# EAGLE design V-00756-00 (EAGLE 7.2.0)
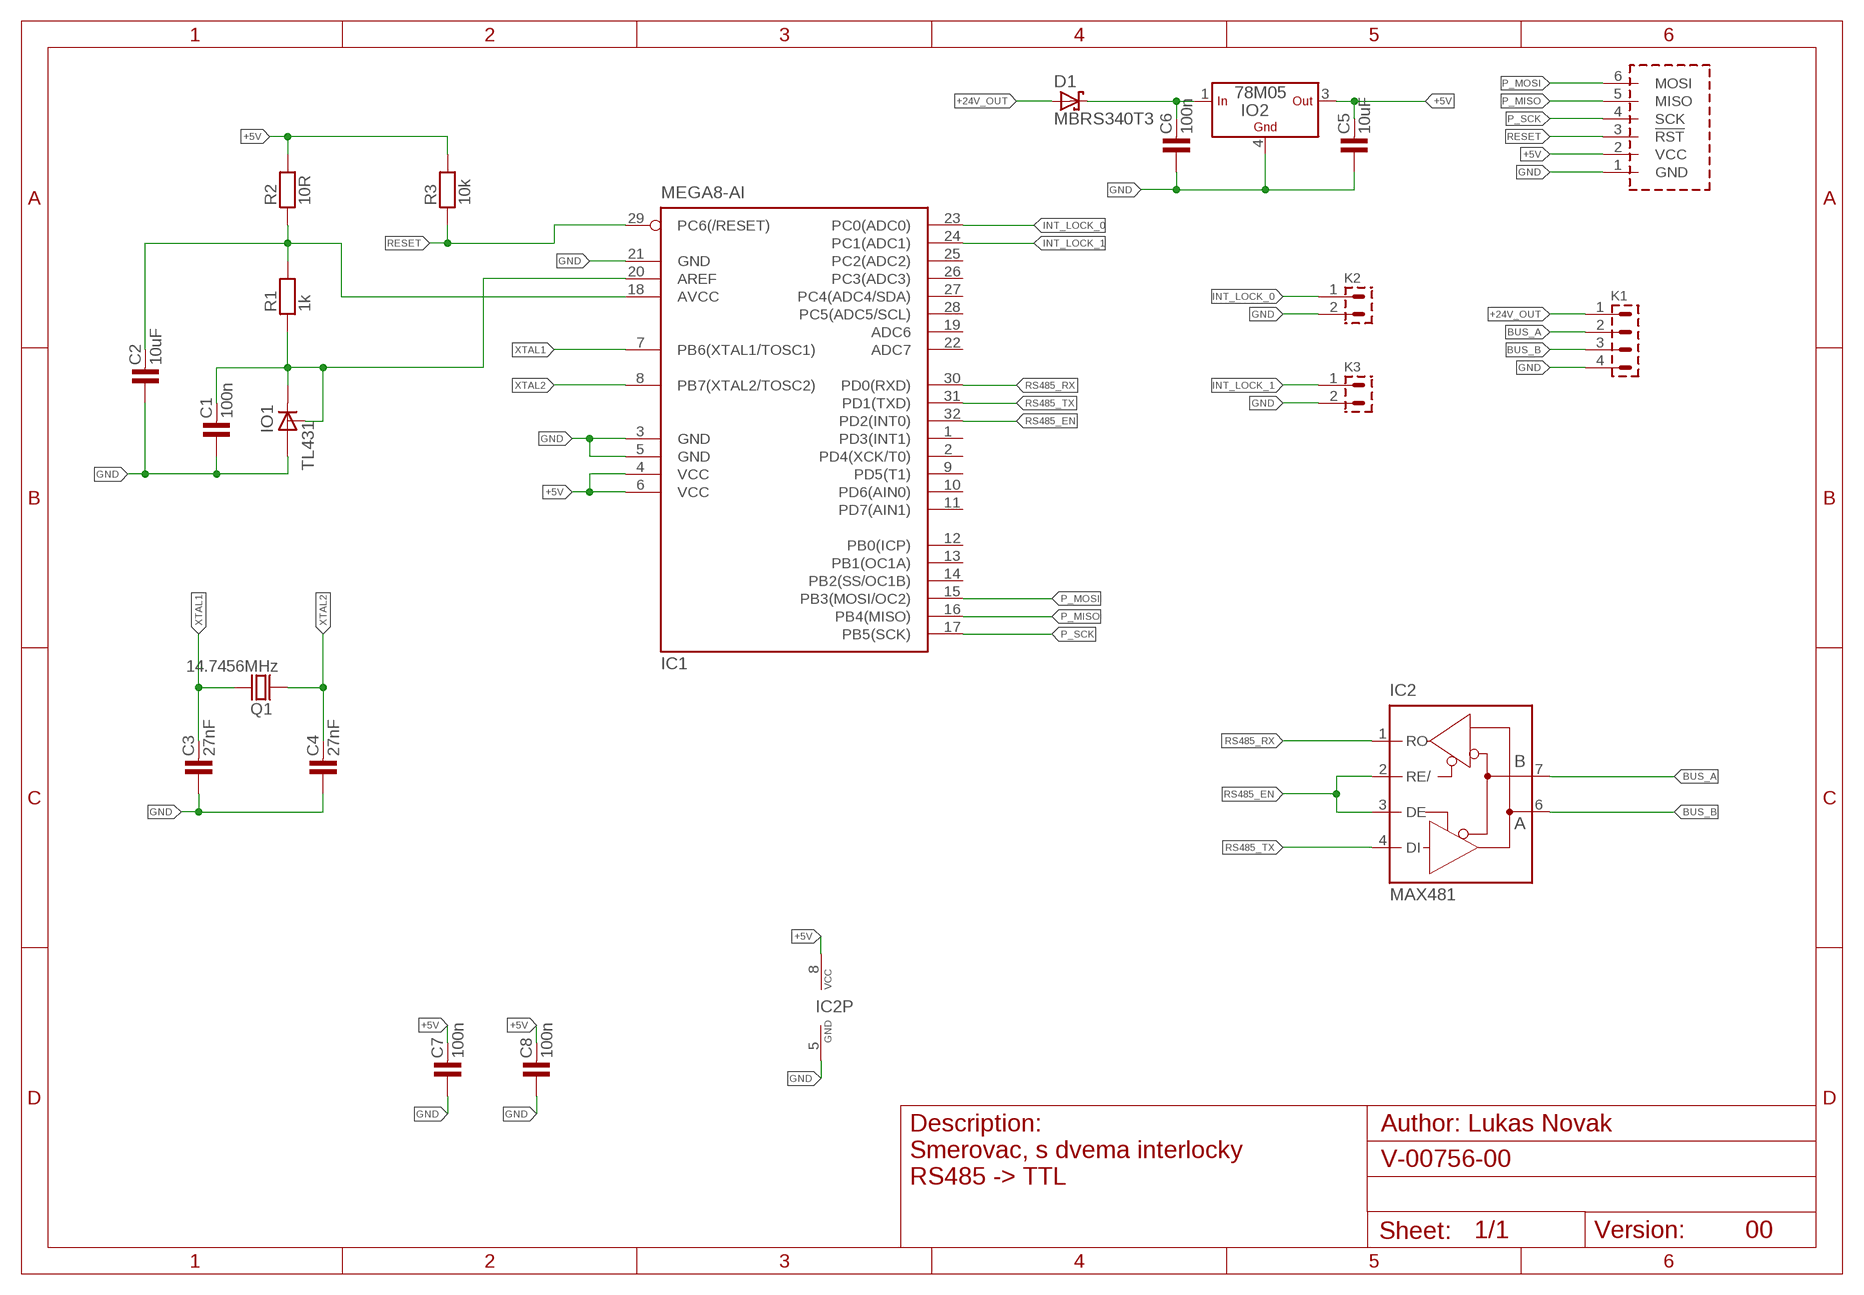
[diagram p0: schematic, sheet 1]

## Parts
C1  100n  C-KER_1206  [1206]
C2  10uF  C-KER_1206  [1206]
C3  27nF  C-KER_0805  [0805]
C4  27nF  C-KER_0805  [0805]
C5  10uF  C-KER_1206  [1206]
C6  100n  C-KER_1206  [1206]
C7  100n  C-KER_1206  [1206]
C8  100n  C-KER_1206  [1206]
D1  MBRS340T3  [SMC]
IC1  MEGA8-AI  [TQFP32-08]
IC2  MAX481  MAX481CSA  [SO08]
IO1  TL431  TL431SOT23  [SOT23]
IO2  78M05  LF_CDT  [DPAK]
K1  PSH02-04W  [PSH02-04W]
K2  PSH02-02W  [PSH02-02W]
K3  PSH02-02W  [PSH02-02W]
Q1  14.7456MHz  Q_HC-49U  [HC-49U]
R1  1k  R_1206  [1206]
R2  10R  R_1206  [1206]
R3  10k  R_1206  [1206]
U$1  AVR_PROG_SPI  [PSH02-06P]

## Nets
+5V: C5.2 C7.2 C8.2 IC1.4(VCC) IC1.6(VCC) IC2.8(VCC) IO2.3(OUT) R2.2 R3.2 U$1.2(VCC)
+24V: C6.2 D1.C IO2.1(IN)
+24V_OUT: D1.A K1.1
AREF: C1.2 IC1.20(AREF) IO1.1(C) IO1.2(R) R1.1
AVCC: C2.2 IC1.18(AVCC) R1.2 R2.1
BUS_A: IC2.7(B) K1.2
BUS_B: IC2.6(A) K1.3
GND: C1.1 C2.1 C3.1 C4.1 C5.1 C6.1 C7.1 C8.1 IC1.3(GND) IC1.5(GND) IC1.21(GND) IC2.5(GND) IO1.3(A) IO2.4(GND) K1.4 K2.2 K3.2 U$1.1(GND)
INT_LOCK_0: IC1.23(PC0(ADC0)) K2.1
INT_LOCK_1: IC1.24(PC1(ADC1)) K3.1
P_MISO: IC1.16(PB4(MISO)) U$1.5(MISO)
P_MOSI: IC1.15(PB3(MOSI/OC2)) U$1.6(MOSI)
P_SCK: IC1.17(PB5(SCK)) U$1.4(SCK)
RESET: IC1.29(PC6(/RESET)) R3.1 U$1.3(!RST)
RS485_EN: IC1.32(PD2(INT0)) IC2.2(RE/) IC2.3(DE)
RS485_RX: IC1.30(PD0(RXD)) IC2.1(RO)
RS485_TX: IC1.31(PD1(TXD)) IC2.4(DI)
XTAL1: C3.2 IC1.7(PB6(XTAL1/TOSC1)) Q1.2
XTAL2: C4.2 IC1.8(PB7(XTAL2/TOSC2)) Q1.1
Unconnected: IC1.1(PD3(INT1)) IC1.2(PD4(XCK/T0)) IC1.9(PD5(T1)) IC1.10(PD6(AIN0)) IC1.11(PD7(AIN1)) IC1.12(PB0(ICP)) IC1.13(PB1(OC1A)) IC1.14(PB2(SS/OC1B)) IC1.19(ADC6) IC1.22(ADC7) IC1.25(PC2(ADC2)) IC1.26(PC3(ADC3)) IC1.27(PC4(ADC4/SDA)) IC1.28(PC5(ADC5/SCL))

## Notes on the sheet
- Smerovac, s dvema interlocky
  RS485 -> TTL
- 00

## Library data of the parts
C1-C8 = #PaJa_31:C-KER: Kondenzator - keramicky
D1 = diode:MBRS3*0T3: SCHOTTKY BARRIER RECTIFIER 3.0 AMPERES 20, 30, 40 VOLT Source: MBRS340T3-D.pdf
IC1 = atmel:MEGA8: MICROCONTROLLER 8 Kbytes FLASH, 1 kbytes SRAM, 512 bytes EEPROM, USART, 6-channel 10 bit ADC, 2-channel 8 bit ADC Pin compatible with Atmega48, ATMega88, ATMega168 Source: avr.lbr; MPN: ATMEGA8-16AU; OC_FARNELL: 9171371; OC_NEWARK: 73M8863
IC2 = maxim:MAX481CSA: RS485 TRANSEIVER; MF: MAXIM; MPN: MAX481CSA; OC_FARNELL: unknown; OC_NEWARK: 90C3817
IO1 = references:TL431: Programmable Shunt Regulator TL431 Features > Programmable Output Voltage to 36 Volts > Low Dynamic Output Impedance 0.2? Typical > Sink Current Capability of 1.0 to 100mA > Equivalent Full-Range Temperature Coefficient of 50ppm/°C Typical > Temperature Compensated For Operation Over Full Rated Operating Temperature Range > Low Output Noise Voltage > Fast Turn-on Response; MPN: TL431BFDT; OC_FARNELL: 2095471; PACKAGE: SOT23; SUPPLIER: NXP
IO2 = #PaJa_31:LF_C: LF??C - stabilizatory low-drop Out= 1,5 / 1,8 / 2,5 / 3,3 / 4,7 / 5 / 6 / 8 / 5,5 / 9 / 12 V Avaiable in +- 1% (AB) , +- 2% (C)
K1 = #PaJa_konektory:PSH02-04: Konektory se zamkem - vidlice - 4pin
K2 K3 = #PaJa_konektory:PSH02-02: Konektory se zamkem - vidlice - 2pin
Q1 = #PaJa_31:Q: Krystal HC-49 - 1MHz - 48MHz DT38 - Quartz (hodinovy) 32,768kHz
R1-R3 = #PaJa_31:R: Rezistor
U$1 = #PaJa_konektory:AVR_PROG_SPI

## Net classes
0 default: width 0.305 mm, drill 0.3 mm, clearance 0.2 mm
2 Supply: width 0.305 mm, drill 0.3 mm, clearance 0.4 mm to class 0
3 Ground: width 0.305 mm, drill 0.3 mm, clearance 0.2 mm to class 0

## Board
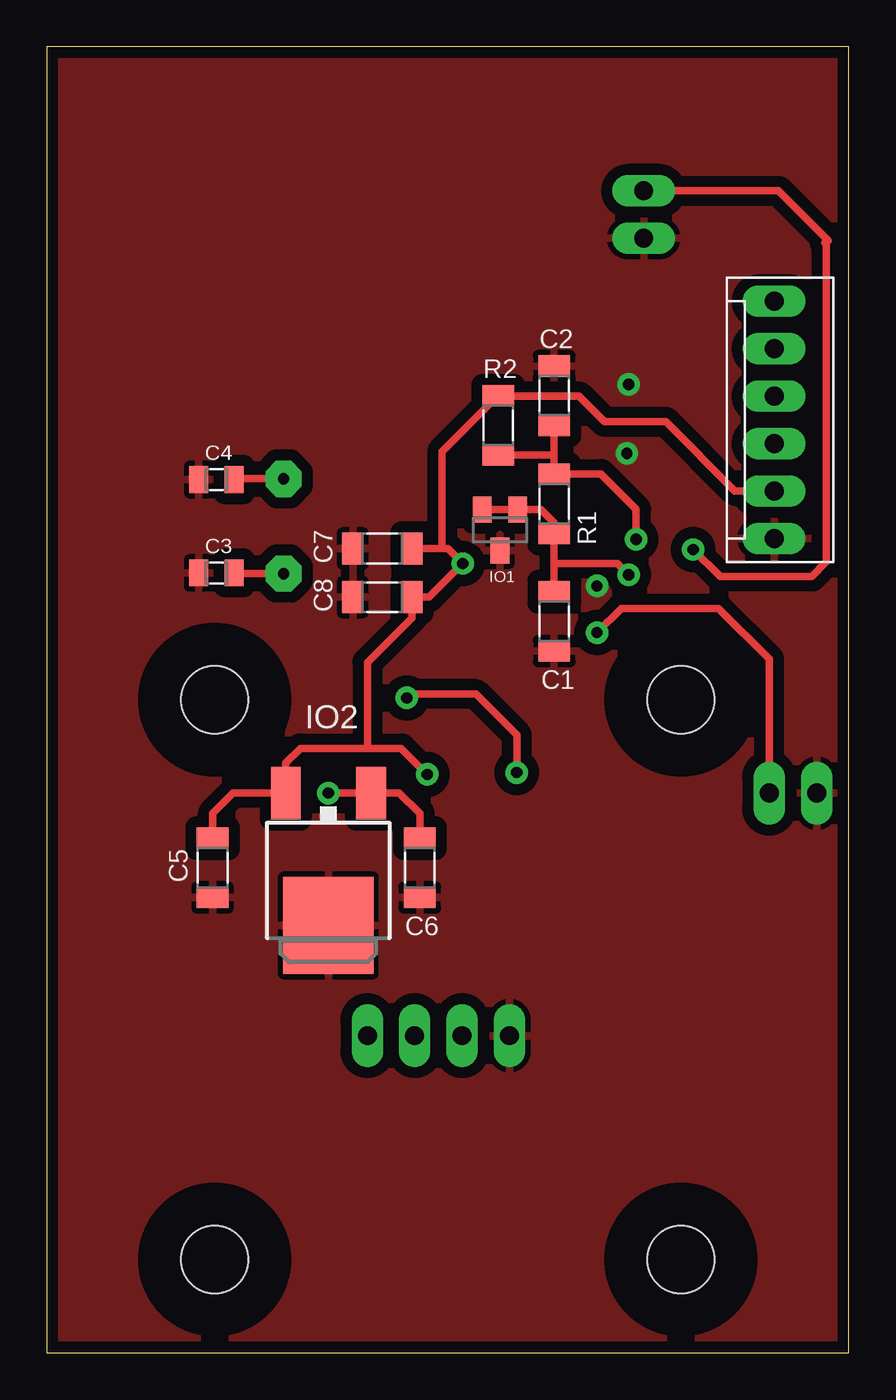
[diagram p1: board, top side]
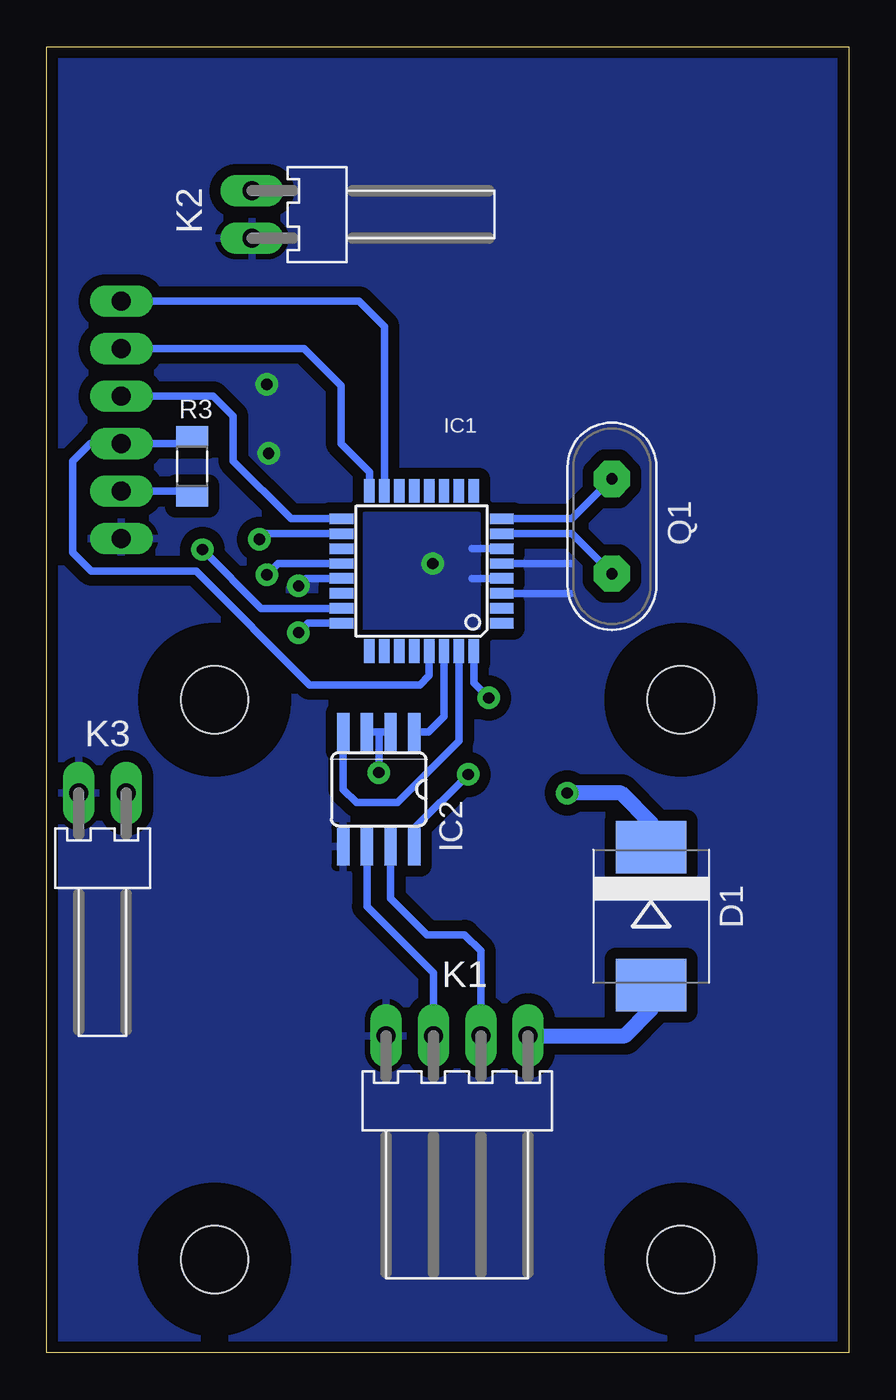
[diagram p2: board, bottom side, seen from below]

Size 43 x 70 mm. Coordinates in mm from the lower left corner, seen from the top.
Outline: 0,0 43,0 43,70 0,70 0,0
Copper layers (1*16): Top 0.04mm / dielectric 1.5mm / Bottom 0.04mm
Design rules "mucha_navrh *": minimum track width 0.2mm, minimum drill 0.6mm, track to track 0.5mm, track to pad 0.5mm, pad to pad 0.3mm, via to via 0.3mm, smd to smd 0mil, copper to edge 0.01mm, drill to drill 0.5mm, minimum pad ring 0.3mm, minimum via ring 0.3mm, stop-mask expansion 0.1mm, vias tented up to drill 0.8mm, thermal gap 0.3mm
Holes 3.6 mm at 9,5 34,5 9,35 34,35
tRestrict: area 30.5,1.5 to 37.5,8.5; area 5.5,1.5 to 12.5,8.5; area 5.5,31.5 to 12.5,38.5; area 30.5,31.5 to 37.5,38.5
bRestrict: area 5.5,1.5 to 12.5,8.5; area 30.5,1.5 to 37.5,8.5; area 5.5,31.5 to 12.5,38.5; area 30.5,31.5 to 37.5,38.5

### Footprints (pad centres in the part's own frame; a part is rotated, then mirrored left to right if it is on the bottom)
1206 = smd 1.143 x 1.702: 1 -1.587,0; 2 1.587,0
0805 = smd 1.016 x 1.422: 1 -0.953,0; 2 0.953,0
SMC = smd 2.8 x 3.8: A 3.7,0; C -3.7,0
TQFP32-08 = smd 1.27 x 0.559: 1 -4.293,2.8; 2 -4.293,2; 3 -4.293,1.2; 4 -4.293,0.4; 5 -4.293,-0.4; 6 -4.293,-1.2; 7 -4.293,-2; 8 -4.293,-2.8; 17 4.293,-2.8; 18 4.293,-2; 19 4.293,-1.2; 20 4.293,-0.4; 21 4.293,0.4; 22 4.293,1.2; 23 4.293,2; 24 4.293,2.8 | smd 0.559 x 1.27: 9 -2.8,-4.293; 10 -2,-4.293; 11 -1.2,-4.293; 12 -0.4,-4.293; 13 0.4,-4.293; 14 1.2,-4.293; 15 2,-4.293; 16 2.8,-4.293; 25 2.8,4.293; 26 2,4.293; 27 1.2,4.293; 28 0.4,4.293; 29 -0.4,4.293; 30 -1.2,4.293; 31 -2,4.293; 32 -2.8,4.293
SO08 = smd 0.66 x 2.032: 1 -1.905,-3.073; 2 -0.635,-3.073; 3 0.635,-3.073; 4 1.905,-3.073; 5 1.905,3.073; 6 0.635,3.073; 7 -0.635,3.073; 8 -1.905,3.073
SOT23 = smd 1 x 1.4: 1 -0.95,-1.1; 2 0.95,-1.1; 3 0,1.1
DPAK = smd 1.6 x 2.8: 1 -2.28,-4.992; 3 2.28,-4.992 | smd 4.826 x 5.191: 4 0,2.096
PSH02-04W = drill 1.016 pad 1.422 long: 1 -3.81,0; 2 -1.27,0; 3 1.27,0; 4 3.81,0
PSH02-02W = drill 1.016 pad 1.422 long: 1 -1.27,0; 2 1.27,0
HC-49U = drill 0.61 pad 1.93 octagon: 1 -2.54,0; 2 2.54,0
PSH02-06P = drill 1.016 pad 1.422 long: 1 -6.35,0; 2 -3.81,0; 3 -1.27,0; 4 1.27,0; 5 3.81,0; 6 6.35,0

### Placement (x,y rotation side)
C1  27.2,39.2 90 top
C2  27.2,51.3 270 top
C3  9.1,41.8 0 top
C4  9.1,46.8 0 top
C5  8.9,26 90 top
C6  20,26 90 top
C7  18,43.1 0 top
C8  18,40.5 0 top
D1  10.6,23.4 270 bottom
IC1  22.9,41.9 180 bottom
IC2  25.2,30.2 180 bottom
IO1  24.3,44.1 180 top
IO2  15.1,25 180 top
K1  21,17 180 bottom
K2  32,61 270 bottom
K3  40,30 180 bottom
Q1  12.7,44.3 270 bottom
R1  27.2,45.5 90 top
R2  24.2,49.7 90 top
R3  35.2,47.5 270 bottom
U$1  39,50 90 top
U$2  [A4L-LOC]  -104.9,-60.5 0 top  (outside the outline)

### Tracks (layer width: path | path; a pad name or v marks a point on that pad's centre or on a via)
+5V  (via drill 0.6)
  Top 0.406: C5.2 8.9,28.9 10,30 10.01,29.99 IO2.3 12.8,30.01 12.8,31.6 13.6,32.4 17.2,32.4 | 17.2,32.4 19,32.4 v20.4,31 | 17.2,32.4 17.2,37 19.59,39.39 C8.2 20.5,40.5 v22.3,42.3 | v22.3,42.3 22.2,42.3 | C7.2 21.2,43.1 | 21.2,43.1 21.5,43.1 v22.3,42.3 | 21.2,43.1 21.2,48.29 R2.2 24.22,51.27 28.53,51.27 29.9,49.9 33.19,49.9 36.9,46.19 U$1.2
  Bottom 0.406: IC1.6 20.2,43.1 | IC1.4 20.2,41.5 | v20.4,31 23.3,28.11 IC2.8 | U$1.2 35.48,46.19 R3.2
  pour Bottom (rank 5): 25.9,38.9 19.9,38.9 19.9,44.9 25.9,44.9
+24V  (via drill 0.6)
  Top 0.406: C6.2 20,28.9 18.9,30 18.89,29.99 IO2.1 15.71,29.99 v15.1,30
  Bottom 0.813: D1.C 10.6,28.4 12.2,30 v15.1,30
+24V_OUT
  Bottom 0.813: K1.1 12,17 10.6,18.4 D1.A
AREF  (via drill 0.6)
  Top 0.406: IO1.2 IO1.1 26.5,45.2 27.2,44.5 R1.1 IC1.20 | IC1.20 C1.2 | v31.2,41.7 30.6,42.3 IC1.20
  Bottom 0.406: IC1.20 30.6,42.3 v31.2,41.7
AVCC  (via drill 0.6)
  Top 0.406: v31.6,43.6 31.59,43.59 31.59,45.21 30.05,46.75 29.71,47.09 | C2.2 27.2,48 | 27.2,48 R1.2 29.71,47.09 | R2.1 27.09,48.11 27.2,48 | 29.71,47.09 29.7,47.1
  Bottom 0.406: IC1.18 31.3,43.9 v31.6,43.6
BUS_A
  Bottom 0.406: IC2.7 24.57,24.36 22.6,22.4 20.6,22.4 19.73,21.53 K1.2
BUS_B
  Bottom 0.406: IC2.6 25.84,23.93 22.27,20.37 K1.3
GND  (via drill 0.6)
  Bottom 0.406: IC1.5 14.9,42.3 | IC1.3 14.9,40.7 | IC1.21 29.1,41.5 v29.5,41.1
  other vias: 31.1,48.2 31.2,51.9
  pour Bottom (isolate 0.6, rank 6): 0,0 43,0 43,70 0,70
  pour Top (isolate 0.6, rank 6): 0,0 43,0 43,70 0,70
INT_LOCK_0  (via drill 0.6)
  Top 0.406: K2.1 39.23,62.27 41.9,59.6 41.8,59.6 41.7,59.5 41.8,59.4 41.8,42.4 41,41.6 36.1,41.6 v34.65,43.05
  Bottom 0.406: IC1.23 31.5,39.9 v34.65,43.05
INT_LOCK_1  (via drill 0.6)
  Top 0.406: v29.5,38.6 30.8,39.9 36,39.9 38.73,37.17 K3.1
  Bottom 0.406: IC1.24 29,39.1 v29.5,38.6
P_MISO
  Bottom 0.406: IC1.16 25.7,47.2 27.23,48.73 27.23,51.83 29.21,53.81 U$1.5
P_MOSI
  Bottom 0.406: U$1.6 26.25,56.35 24.9,55 IC1.15
P_SCK
  Bottom 0.406: U$1.4 34.07,51.27 33,50.2 33,47.8 29.9,44.7 IC1.17
RESET
  Bottom 0.406: IC1.29 22.5,36.3 23,35.8 28.9,35.8 35,41.9 40.6,41.9 41.6,42.9 41.6,47.8 40.67,48.73 U$1.3 35.56,48.73 R3.1
RS485_EN  (via drill 0.6)
  Top 0.406: v19.3,35.1 19.5,35.3 23,35.3 25.2,33.1 v25.2,31.1
  Bottom 0.406: IC2.3 25.19,33.27 | 25.19,33.27 IC2.2 | v19.3,35.1 20.1,35.9 IC1.32 | 25.19,33.27 v25.19,31.11 v25.2,31.1
RS485_RX
  Bottom 0.406: IC1.30 21.7,34.1 22.53,33.27 IC2.1
RS485_TX
  Bottom 0.406: IC1.31 20.9,32.8 24.2,29.5 26.4,29.5 27.11,30.2 IC2.4
XTAL1
  Top 0.406: Q1.2 10.09,41.76 C3.2
  Bottom 0.406: IC1.7 14.84,43.9 Q1.2
XTAL2
  Top 0.406: Q1.1 10.09,46.84 C4.2
  Bottom 0.406: IC1.8 14.84,44.7 Q1.1

### Text on the board
Document: DPS pro smerovac / se dvema interlocky | Top | 00